# EAGLE design PhotoSW4 (EAGLE 4.09)
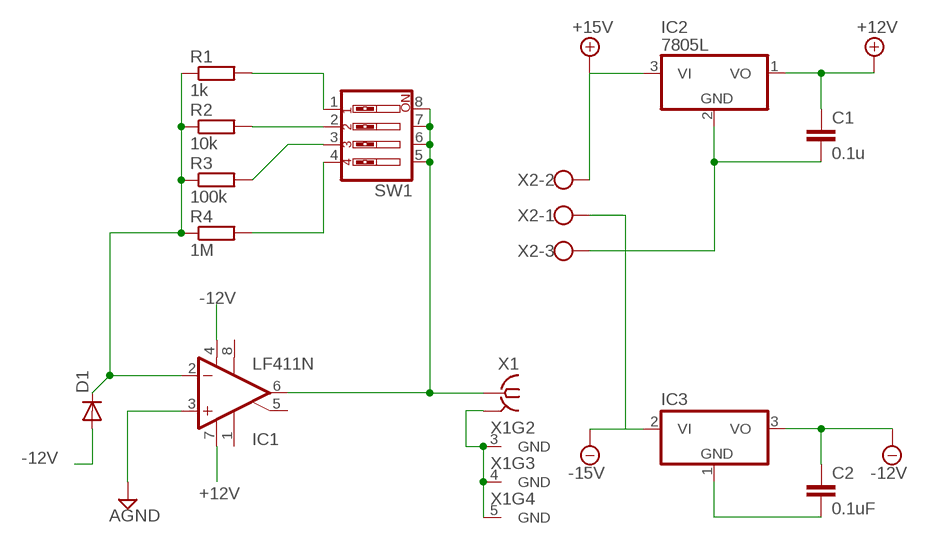
[diagram p0: schematic, sheet 1]

## Parts
C1  0.1u  C-EU050-030X075  [C050-030X075]
C2  0.1uF  C-EU050-030X075  [C050-030X075]
D1  DIODE-D-5  [D-5]
IC1  LF411N  [DIL08]
IC2  7805L  [TO92]
IC3  7905L  [TO92]
R1  1k  R-EU_0204/7  [0204/7]
R2  10k  R-EU_0204/7  [0204/7]
R3  100k  R-EU_0204/7  [0204/7]
R4  1M  R-EU_0204/7  [0204/7]
SW1  SW_DIP-4  [EDG-04]
X1  BU-SMA-G  [BU-SMA-G]
X2  AK300/3  [AK300/3]

## Nets
+12V [power]: C1.1 IC1.7(V+) IC2.1(VO)
+15V [power]: IC2.3(VI) X2.2
-12V [power]: C2.1 D1.A IC1.4(V-) IC3.3(VO)
-15V [power]: IC3.2(VI) X2.1
AGND [power]: C1.2 C2.2 IC1.3(+IN) IC2.2(GND) IC3.1(GND) X1.2(GND) X1.3(GND) X1.4(GND) X1.5(GND) X2.3
INPUT: D1.C IC1.2(-IN) R1.1 R2.1 R3.1 R4.1
N$2: R1.2 SW1.1
N$3: R2.2 SW1.2
N$4: R3.2 SW1.3
N$5: R4.2 SW1.4
OUTPUT: IC1.6(OUT) SW1.5 SW1.6 SW1.7 SW1.8 X1.1
Unconnected: IC1.1(ON1) IC1.5(ON2) IC1.8(OPT)

## Library data of the parts
C1 C2 = rcl:C-EU: CAPACITOR, European symbol
D1 = diode:DIODE-: DIODE
IC1 = linear:LF411: OP AMP
IC2 = linear:78*: Positive VOLTAGE REGULATOR
IC3 = linear:79*: Negative VOLTAGE REGULATOR
R1-R4 = rcl:R-EU_: RESISTOR, European symbol
SW1 = special:SW_DIP-4: DIP SWITCH
X1 = con-coax:BU-SMA-G: FEMALE SMA CONNECTOR Radiall distributor RS 193-9117
X2 = con-ptr500:AK300/3: CONNECTOR

## Net classes
0 default: width 0.508 mm, drill 0.508 mm
1 power: width 1.27 mm, drill 0.762 mm

## Board
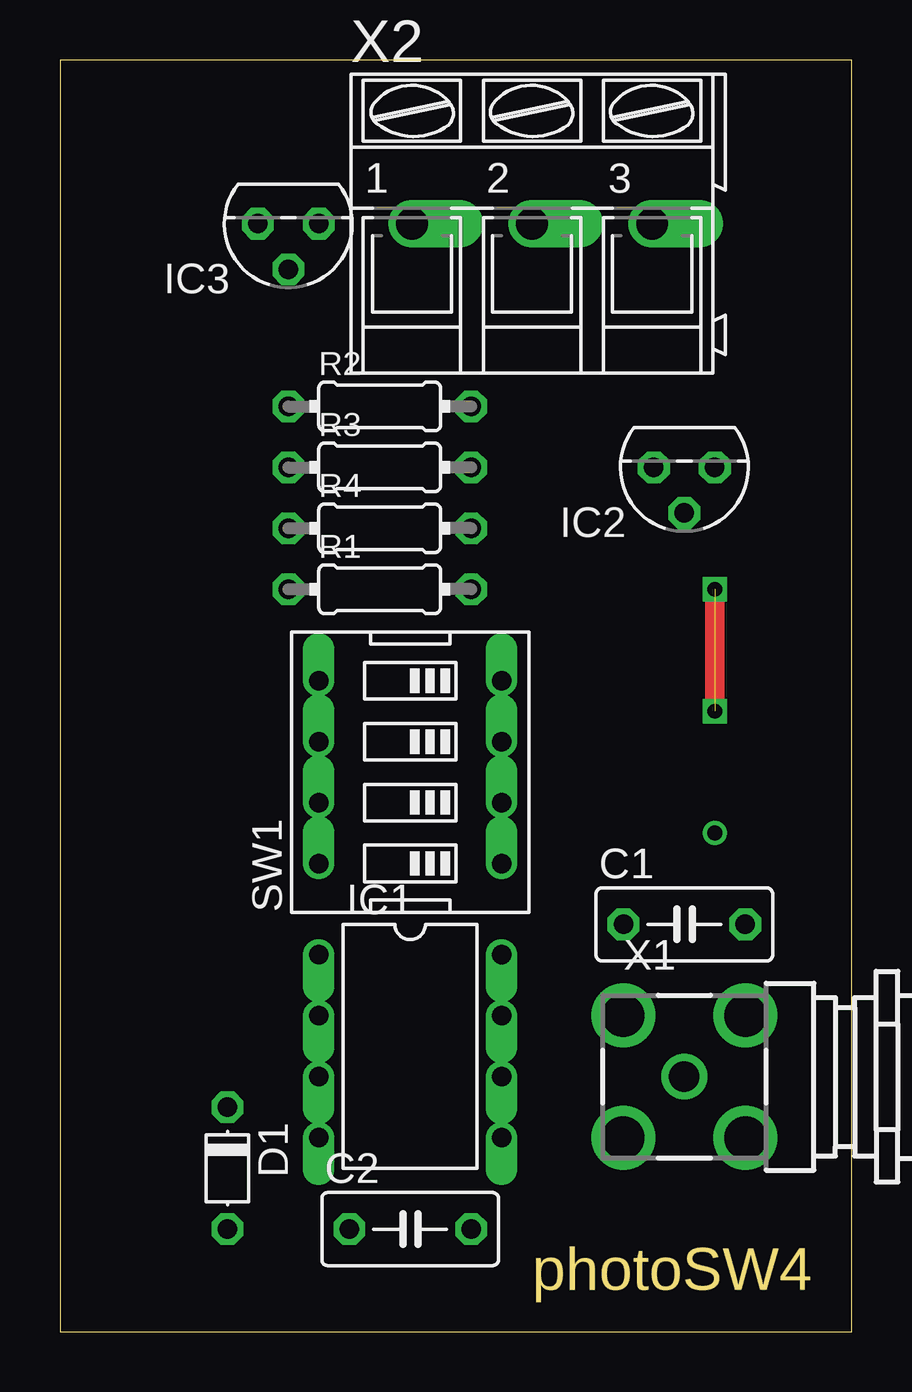
[diagram p1: board, top side]
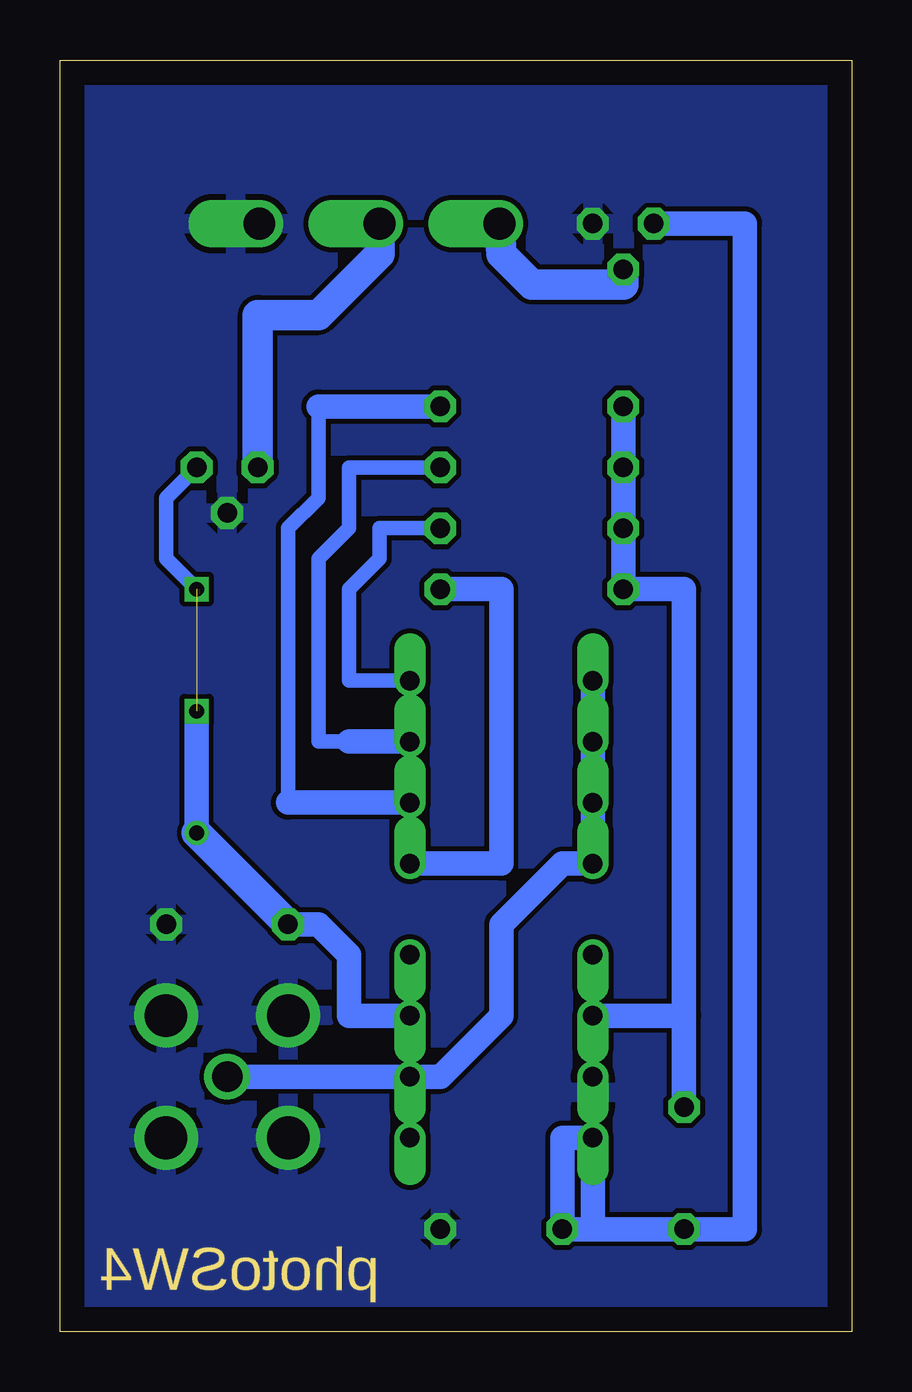
[diagram p2: board, bottom side, seen from below]

Size 33 x 53.01 mm. Coordinates in mm from the lower left corner, seen from the top.
Outline: 0,0 33,0 33,53.01 0,53.01 0,0
Copper layers used: Top, Bottom
tRestrict: 8 lines

### Footprints (pad centres in the part's own frame; a part is rotated, then mirrored left to right if it is on the bottom)
C050-030X075 = drill 0.813 octagon: 1 -2.54,0; 2 2.54,0
D-5 = drill 0.813 octagon: A 2.54,0; C -2.54,0
DIL08 = drill 0.813 offset: 1 -3.81,-3.81; 2 -1.27,-3.81; 3 1.27,-3.81; 4 3.81,-3.81; 5 3.81,3.81; 6 1.27,3.81; 7 -1.27,3.81; 8 -3.81,3.81
TO92 = drill 0.813 octagon: 1 -1.27,0; 2 0,1.905; 3 1.27,0
0204/7 = drill 0.813 octagon: 1 -3.81,0; 2 3.81,0
EDG-04 = drill 0.813 offset: 1 -3.81,-3.81; 2 -1.27,-3.81; 3 1.27,-3.81; 4 3.81,-3.81; 5 3.81,3.81; 6 1.27,3.81; 7 -1.27,3.81; 8 -3.81,3.81
BU-SMA-G = drill 1.27 round: 1 0,0 | drill 1.778 round: 2 -2.55,2.55; 3 2.55,2.55; 4 2.55,-2.55; 5 -2.55,-2.55
AK300/3 = drill 1.321 offset: 1 -5.004,0; 2 0,0; 3 5.004,0

### Placement (x,y rotation side)
C1  26.03,16.98 0 top
C2  14.6,4.28 0 top
D1  6.98,6.82 270 top
IC1  14.6,11.9 270 top
IC2  26.03,36.03 180 top
IC3  9.52,46.19 180 top
R1  13.33,30.95 0 top
R2  13.33,38.57 0 top
R3  13.33,36.03 0 top
R4  13.33,33.49 0 top
SW1  14.6,23.33 90 top
X1  26.03,10.63 0 top
X2  19.68,46.19 0 top

### Tracks (layer width: path | path; a pad name or v marks a point on that pad's centre or on a via)
+12V  (via drill 0.61)  (1 unrouted)
  Bottom 0.61: IC2.1 28.57,34.76 28.57,32.22 27.3,30.95
  Bottom 1.016: IC1.7 20.95,13.17 20.95,15.71 22.22,16.98 C1.1 | v27.3,20.79 27.3,25.87
  Bottom 1.27: C1.1 v27.3,20.79
+15V
  Bottom 1.27: IC2.3 24.76,42.38 22.22,42.38 19.68,44.92 X2.2
-12V
  Bottom 1.016: IC3.3 4.44,46.19 4.44,4.28 D1.A | D1.A 10.79,4.28 IC1.4 12.06,8.09 C2.1 D1.A
-15V
  Bottom 1.27: IC3.2 9.52,43.65 13.33,43.65 14.6,44.92 X2.1
AGND
  pour Bottom: 0.63,52.54 32.38,52.54 32.38,0.47 0.63,0.47
INPUT
  Bottom 1.016: D1.C 6.98,13.17 | R4.1 R3.1 R2.1 R1.1 6.98,30.95 6.98,13.17 | 6.98,13.17 IC1.2
N$1  (via drill 0.61)
  Top 0.813: v27.3,30.95 v27.3,25.87
N$2
  Bottom 1.016: SW1.1 14.6,19.52 14.6,30.95 R1.2
N$3
  Bottom 0.61: 23.49,22.06 23.49,33.49 22.22,34.76 22.22,38.57
  Bottom 1.016: SW1.2 23.49,22.06 | 22.22,38.57 R2.2
N$4
  Bottom 0.61: 20.95,24.6 22.22,24.6 22.22,32.22 20.95,33.49 20.95,36.03 R3.2
  Bottom 1.016: SW1.3 20.95,24.6
N$5
  Bottom 0.61: SW1.4 20.95,27.14 20.95,30.95 19.68,32.22 19.68,33.49 R4.2
OUTPUT
  Bottom 1.016: X1.1 IC1.6 17.14,10.63 14.6,13.17 14.6,16.98 12.06,19.52 SW1.8 SW1.7 SW1.6 SW1.5

### Text on the board
Vias: photoSW4
Dimension: photoSW4